# Altium schematic sheet P1.schdoc
size 420 x 297 mm; Symbol: Drawing-Symbol_A4; Company: 嘉立创EDA; Version: V1.0; Page Size: A4; @Project Name: 24V控制器3; @Update Date: 2026-08-31; @Create Date: 2026-08-31; Device: Drawing-Symbol_A4; @Board Name: Board1; @Page Name: P1; @Create Time: 10:06:53; @Page Count: 1; @Page No: 1; @Schematic Name: Schematic1; @Update Time: 10:06:53; @Assembly Variant: Basic; Border: 1; Title Block Position: 3; Size: A4; Width: 1655; Height: 1170; Region Start: 1; X Region Count: 6; Y Region Count: 4; Blade Width: 10; SheetNumber: 1; SheetTotal: 1
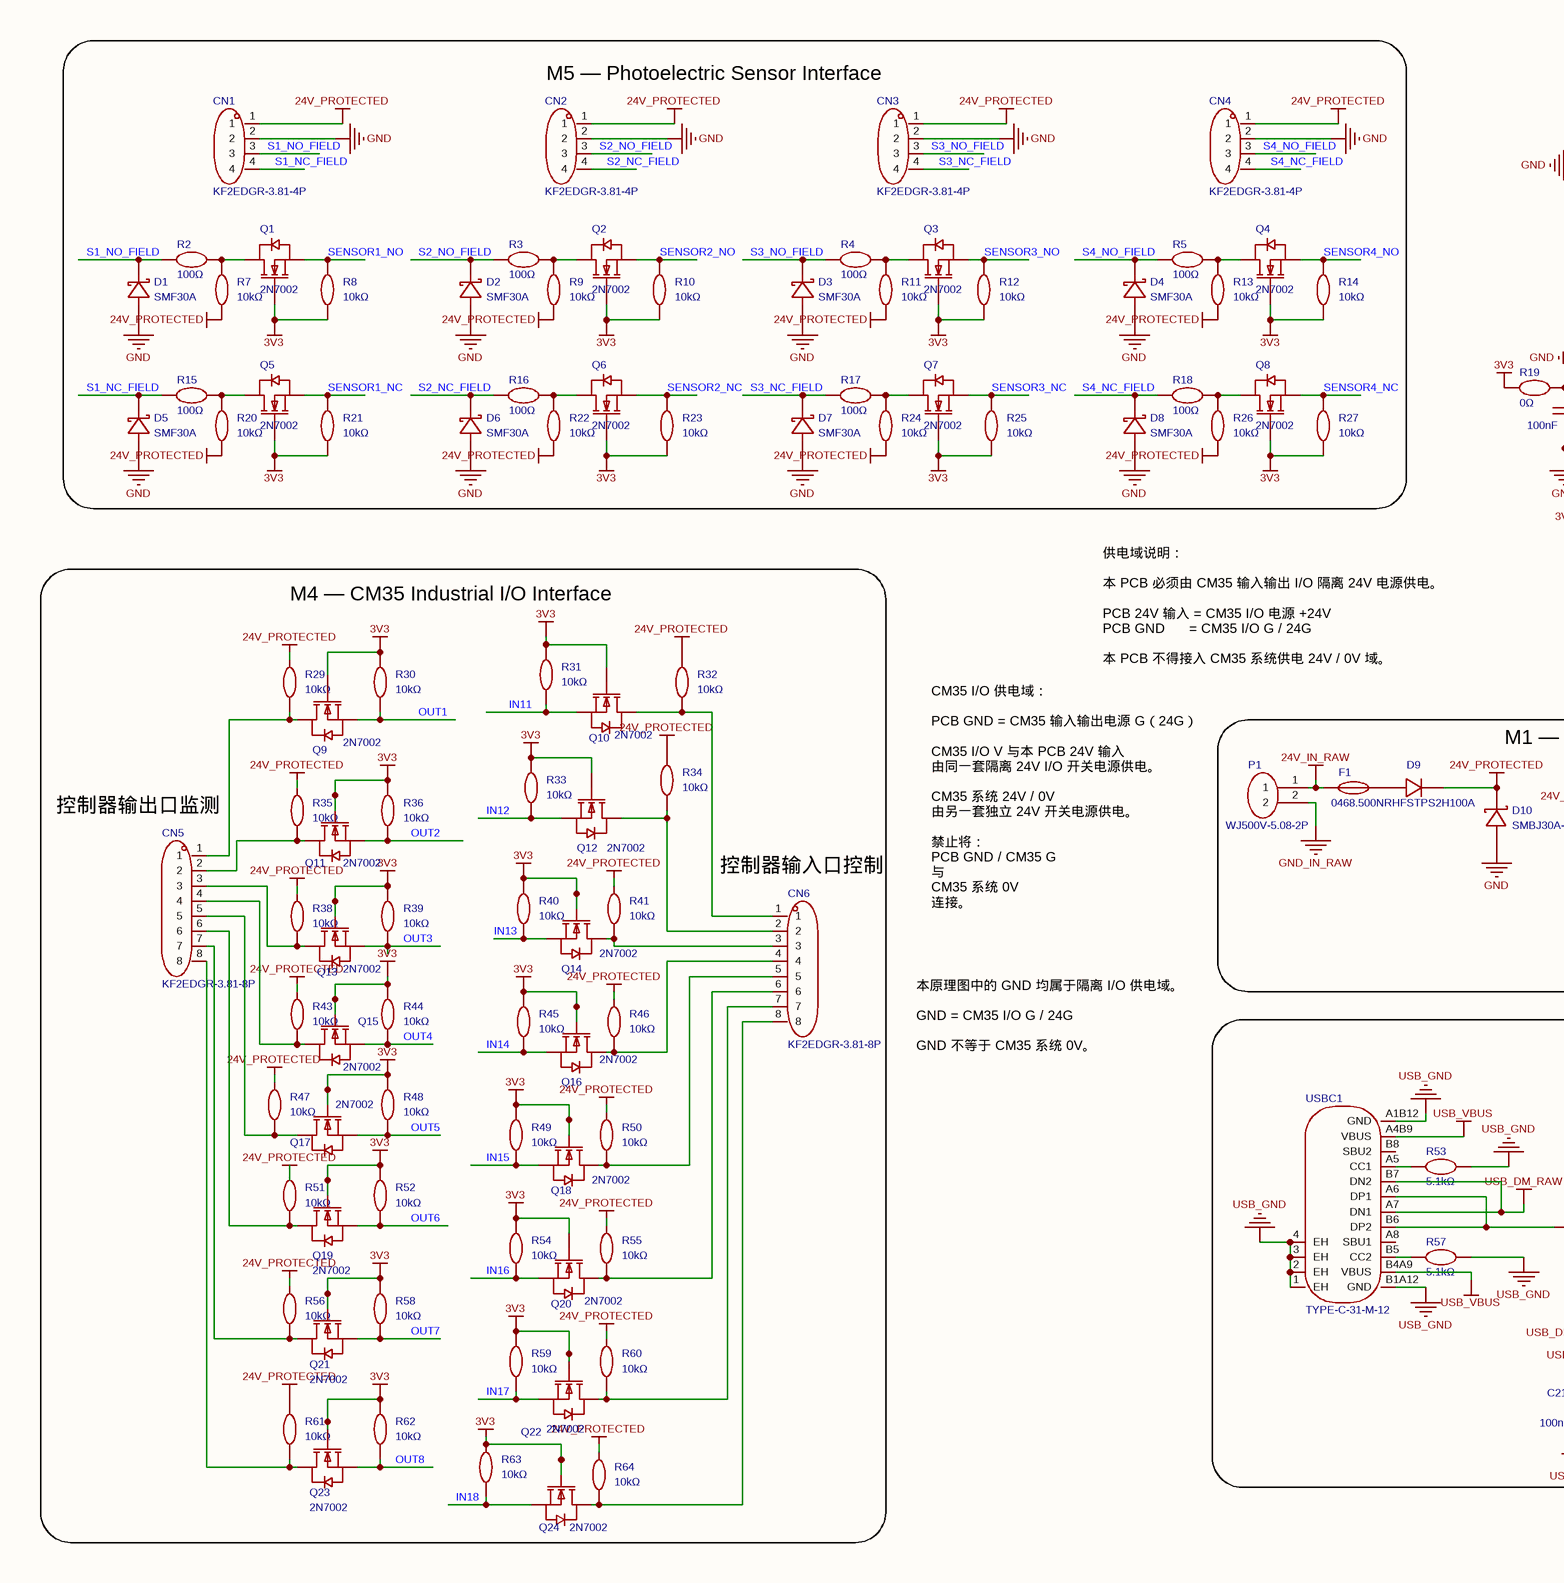
[diagram p0: P1.schdoc, left]
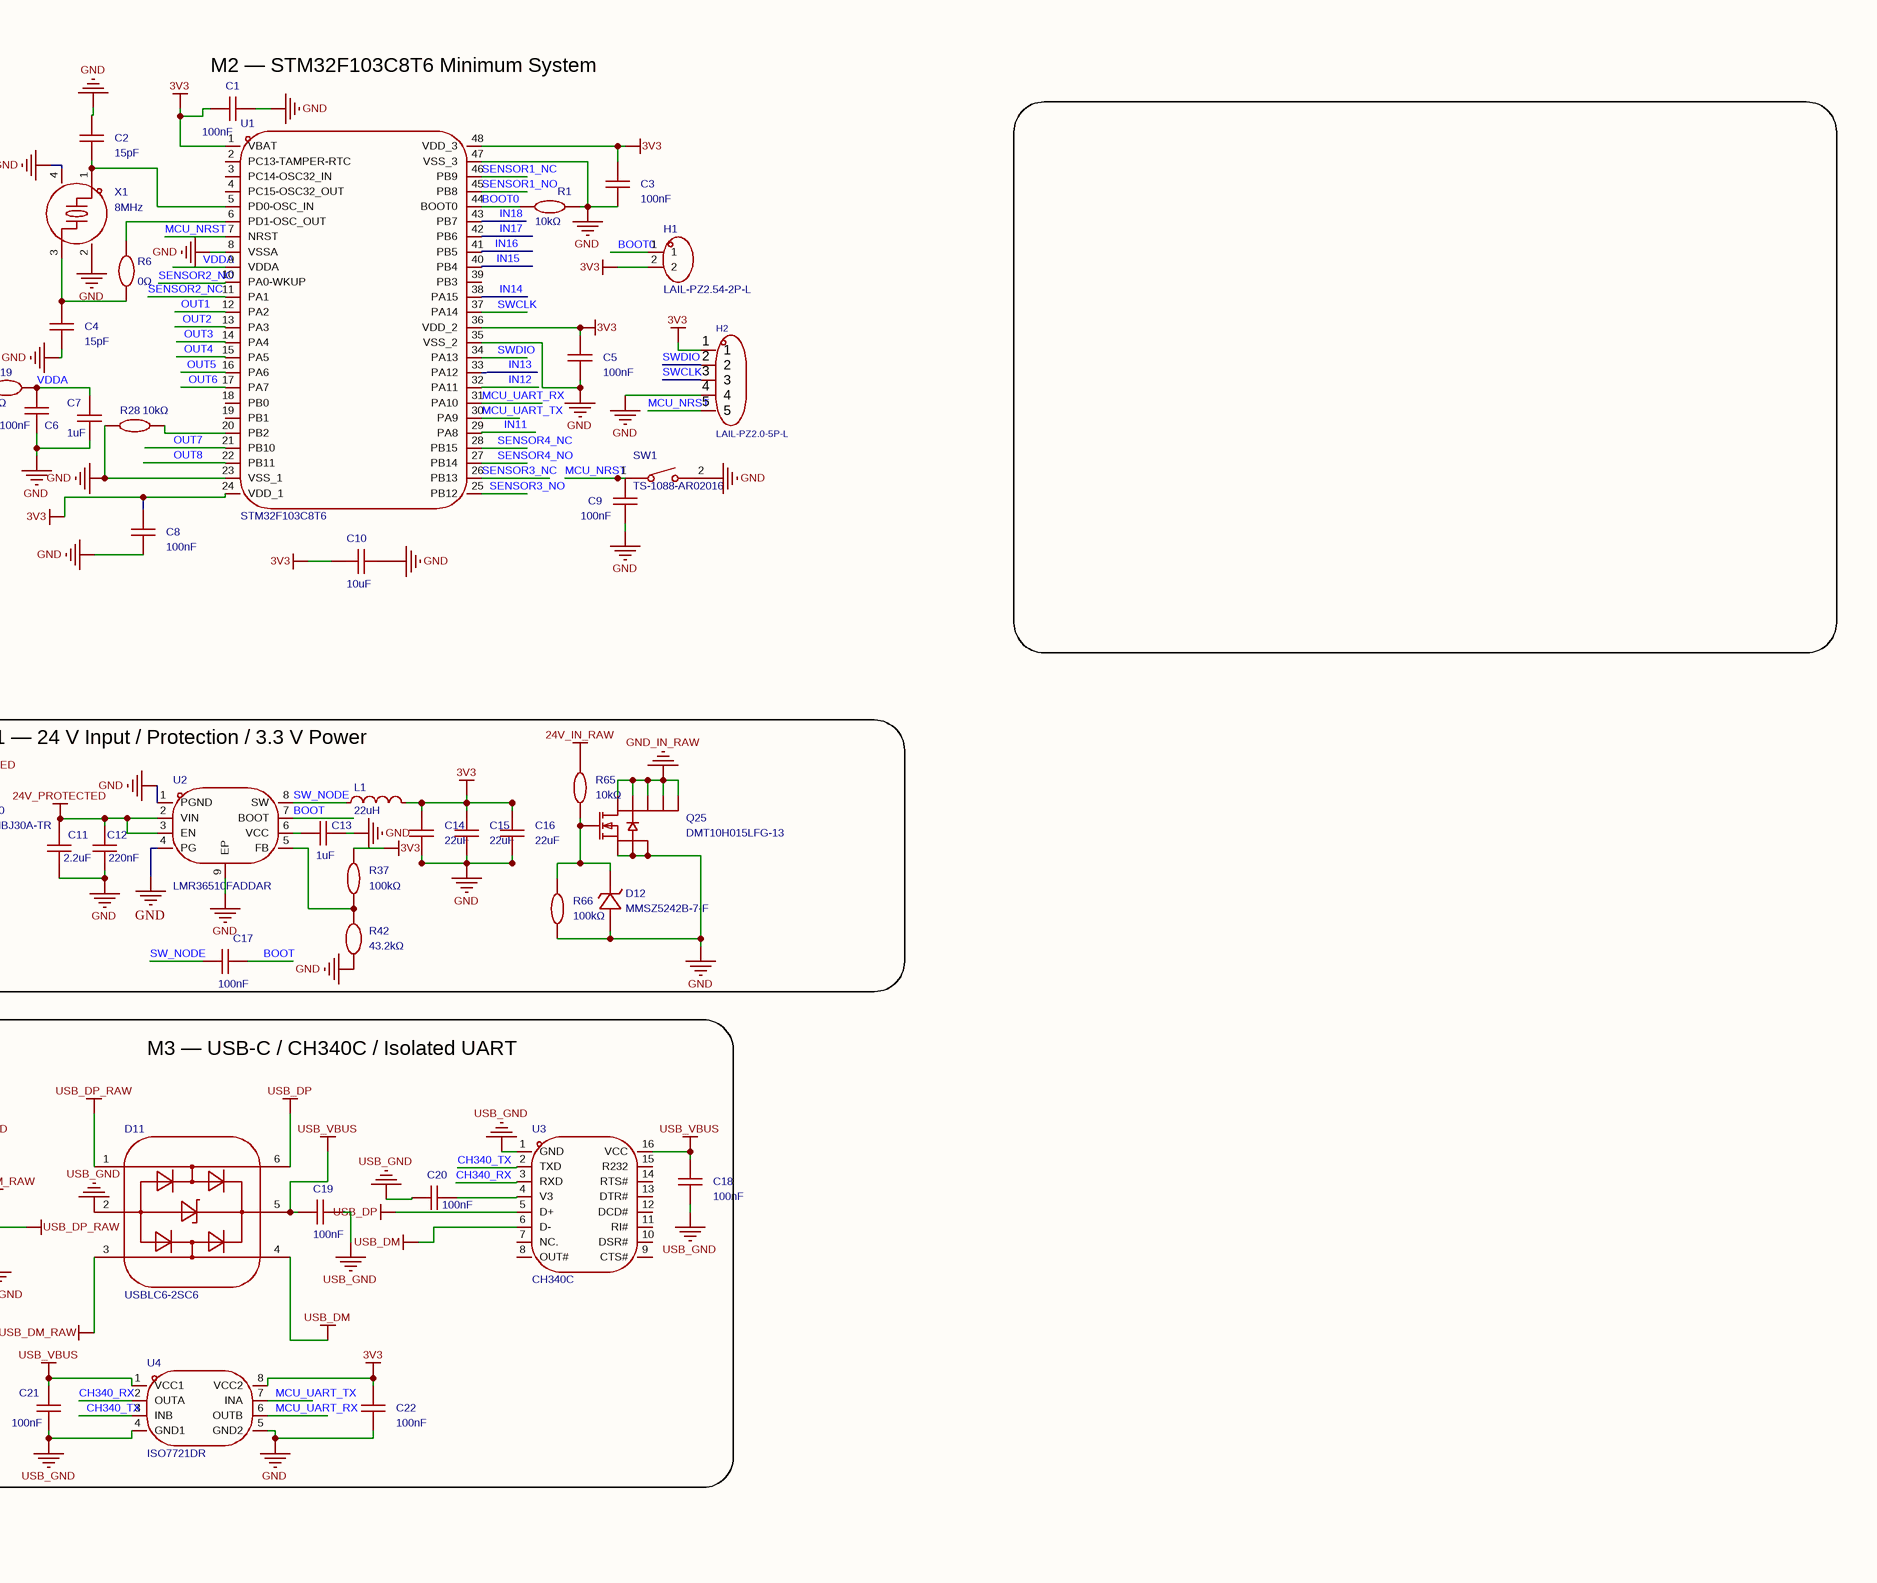
[diagram p1: P1.schdoc, right]

## Parts
C1  100nF  [C0603]
C2  15pF  [C0603]
C3  100nF  [C0603]
C4  15pF  [C0603]
C5  100nF  [C0603]
C6  100nF  [C0603]
C7  1uF  [C0603]
C8  100nF  [C0603]
C9  100nF  [C0603]
C10  10uF  [C0805]
C11  2.2uF  [C1206]
C12  220nF  [C0805]
C13  1uF  [C0603]
C14  22uF  [C1206]
C15  22uF  [C1206]
C16  22uF  [C1206]
C17  100nF  [C0603]
C18  100nF  [C0603]
C19  100nF  [C0603]
C20  100nF  [C0603]
C21  100nF  [C0603]
C22  100nF  [C0603]
CN1  KF2EDGR-3.81-4P  [CONN-TH_4P-P3.81_KF2EDGR-3.81-4P]
CN2  KF2EDGR-3.81-4P  [CONN-TH_4P-P3.81_KF2EDGR-3.81-4P]
CN3  KF2EDGR-3.81-4P  [CONN-TH_4P-P3.81_KF2EDGR-3.81-4P]
CN4  KF2EDGR-3.81-4P  [CONN-TH_4P-P3.81_KF2EDGR-3.81-4P]
CN5  KF2EDGR-3.81-8P  [CONN-TH_8P-P3.81_KF2EDGR-3.81-8P]
CN6  KF2EDGR-3.81-8P  [CONN-TH_8P-P3.81_KF2EDGR-3.81-8P]
D1  SMF30A  [SOD-123FL_L2.7-W1.8-LS3.7-R-RD]
D2  SMF30A  [SOD-123FL_L2.7-W1.8-LS3.7-R-RD]
D3  SMF30A  [SOD-123FL_L2.7-W1.8-LS3.7-R-RD]
D4  SMF30A  [SOD-123FL_L2.7-W1.8-LS3.7-R-RD]
D5  SMF30A  [SOD-123FL_L2.7-W1.8-LS3.7-R-RD]
D6  SMF30A  [SOD-123FL_L2.7-W1.8-LS3.7-R-RD]
D7  SMF30A  [SOD-123FL_L2.7-W1.8-LS3.7-R-RD]
D8  SMF30A  [SOD-123FL_L2.7-W1.8-LS3.7-R-RD]
D9  STPS2H100A  [SMA_L4.4-W2.6-LS5.0-RD]
D10  SMBJ30A-TR  [SMB_L4.6-W3.6-LS5.3-RD]
D11  USBLC6-2SC6  [SOT-23-6_L2.9-W1.6-P0.95-LS2.8-BL]
D12  MMSZ5242B-7-F  [SOD-123_L2.7-W1.6-LS3.7-RD-1]
F1  0468.500NRHF  [F1206]
H1  LAIL-PZ2.54-2P-L  [CONN-TH_LAIL-PZ2.54-2P-L]
H2  LAIL-PZ2.0-5P-L  [HDR-TH_LAIL-PZ2.0-5P-L]
L1  22uH  [IND-SMD_L6.0-W6.0_SWPA6045S]
P1  WJ500V-5.08-2P  [CONN-TH_2P-P5.00_WJ500V-5.08-2P]
Q1  2N7002  [SOT-23-3_L2.9-W1.3-P1.90-LS2.4-BR]
Q2  2N7002  [SOT-23-3_L2.9-W1.3-P1.90-LS2.4-BR]
Q3  2N7002  [SOT-23-3_L2.9-W1.3-P1.90-LS2.4-BR]
Q4  2N7002  [SOT-23-3_L2.9-W1.3-P1.90-LS2.4-BR]
Q5  2N7002  [SOT-23-3_L2.9-W1.3-P1.90-LS2.4-BR]
Q6  2N7002  [SOT-23-3_L2.9-W1.3-P1.90-LS2.4-BR]
Q7  2N7002  [SOT-23-3_L2.9-W1.3-P1.90-LS2.4-BR]
Q8  2N7002  [SOT-23-3_L2.9-W1.3-P1.90-LS2.4-BR]
Q9  2N7002  [SOT-23-3_L2.9-W1.3-P1.90-LS2.4-BR]
Q10  2N7002  [SOT-23-3_L2.9-W1.3-P1.90-LS2.4-BR]
Q11  2N7002  [SOT-23-3_L2.9-W1.3-P1.90-LS2.4-BR]
Q12  2N7002  [SOT-23-3_L2.9-W1.3-P1.90-LS2.4-BR]
Q13  2N7002  [SOT-23-3_L2.9-W1.3-P1.90-LS2.4-BR]
Q14  2N7002  [SOT-23-3_L2.9-W1.3-P1.90-LS2.4-BR]
Q15  2N7002  [SOT-23-3_L2.9-W1.3-P1.90-LS2.4-BR]
Q16  2N7002  [SOT-23-3_L2.9-W1.3-P1.90-LS2.4-BR]
Q17  2N7002  [SOT-23-3_L2.9-W1.3-P1.90-LS2.4-BR]
Q18  2N7002  [SOT-23-3_L2.9-W1.3-P1.90-LS2.4-BR]
Q19  2N7002  [SOT-23-3_L2.9-W1.3-P1.90-LS2.4-BR]
Q20  2N7002  [SOT-23-3_L2.9-W1.3-P1.90-LS2.4-BR]
Q21  2N7002  [SOT-23-3_L2.9-W1.3-P1.90-LS2.4-BR]
Q22  2N7002  [SOT-23-3_L2.9-W1.3-P1.90-LS2.4-BR]
Q23  2N7002  [SOT-23-3_L2.9-W1.3-P1.90-LS2.4-BR]
Q24  2N7002  [SOT-23-3_L2.9-W1.3-P1.90-LS2.4-BR]
Q25  DMT10H015LFG-13  [POWERDI3333-8_L3.3-W3.3-P0.65-LS3.7-BL-EP]
R1  10kΩ  [R0603]
R2  100Ω  [R0603]
R3  100Ω  [R0603]
R4  100Ω  [R0603]
R5  100Ω  [R0603]
R6  0Ω  [R0603]
R7  10kΩ  [R0603]
R8  10kΩ  [R0603]
R9  10kΩ  [R0603]
R10  10kΩ  [R0603]
R11  10kΩ  [R0603]
R12  10kΩ  [R0603]
R13  10kΩ  [R0603]
R14  10kΩ  [R0603]
R15  100Ω  [R0603]
R16  100Ω  [R0603]
R17  100Ω  [R0603]
R18  100Ω  [R0603]
R19  0Ω  [R0603]
R20  10kΩ  [R0603]
R21  10kΩ  [R0603]
R22  10kΩ  [R0603]
R23  10kΩ  [R0603]
R24  10kΩ  [R0603]
R25  10kΩ  [R0603]
R26  10kΩ  [R0603]
R27  10kΩ  [R0603]
R28  10kΩ  [R0603]
R29  10kΩ  [R0603]
R30  10kΩ  [R0603]
R31  10kΩ  [R0603]
R32  10kΩ  [R0603]
R33  10kΩ  [R0603]
R34  10kΩ  [R0603]
R35  10kΩ  [R0603]
R36  10kΩ  [R0603]
R37  100kΩ  [R0603]
R38  10kΩ  [R0603]
R39  10kΩ  [R0603]
R40  10kΩ  [R0603]
R41  10kΩ  [R0603]
R42  43.2kΩ  [R0603]
R43  10kΩ  [R0603]
R44  10kΩ  [R0603]
R45  10kΩ  [R0603]
R46  10kΩ  [R0603]
R47  10kΩ  [R0603]
R48  10kΩ  [R0603]
R49  10kΩ  [R0603]
R50  10kΩ  [R0603]
R51  10kΩ  [R0603]
R52  10kΩ  [R0603]
R53  5.1kΩ  [R0603]
R54  10kΩ  [R0603]
R55  10kΩ  [R0603]
R56  10kΩ  [R0603]
R57  5.1kΩ  [R0603]
R58  10kΩ  [R0603]
R59  10kΩ  [R0603]
R60  10kΩ  [R0603]
R61  10kΩ  [R0603]
R62  10kΩ  [R0603]
R63  10kΩ  [R0603]
R64  10kΩ  [R0603]
R65  10kΩ  [R0603]
R66  100kΩ  [R0603]
SW1  TS-1088-AR02016  [SW-SMD_L3.9-W3.0-P4.45]
U1  STM32F103C8T6  [LQFP-48_L7.0-W7.0-P0.50-LS9.0-BL]
U2  LMR36510FADDAR  [ESOP-8_L4.9-W3.9-P1.27-LS6.0-BL-EP-1]
U3  CH340C  [SOP-16_L10.0-W3.9-P1.27-LS6.0-BL]
U4  ISO7721DR  [SOIC-8_L5.0-W4.0-P1.27-LS6.0-BL]
USBC1  TYPE-C-31-M-12  [USB-C_SMD-TYPE-C-31-M-12_1]
X1  8MHz  [CRYSTAL-SMD_4P-L3.2-W2.5-BL]

## Blocks framed on the sheet
M5 — Photoelectric Sensor Interface: CN1-CN4 D1-D8 Q1-Q8 R2-R5 R7-R18 R20-R27
M1 — 24 V Input / Protection / 3.3 V Power: C11-C17 D9 D10 D12 F1 L1 P1 Q25 R37 R42 R65 R66 U2
M3 — USB-C / CH340C / Isolated UART: C18-C22 D11 R53 R57 U3 U4 USBC1

## Nets
3V3: C1.2 C3.2 C5.2 C8.2 C10.1 C14.2 C15.2 C16.2 C22.2 H1.2 H2.1 L1.2 Q1.1(G) Q2.1(G) Q3.1(G) Q4.1(G) Q5.1(G) Q6.1(G) Q7.1(G) Q8.1(G) Q9.1(G) Q10.1(G) Q11.1(G) Q12.1(G) Q13.1(G) Q14.1(G) Q15.1(G) Q16.1(G) Q17.1(G) Q18.1(G) Q19.1(G) Q20.1(G) Q21.1(G) Q22.1(G) Q23.1(G) Q24.1(G) R8.1 R10.1 R12.1 R14.1 R19.1 R21.1 R23.1 R25.1 R27.1 R30.2 R31.2 R33.2 R36.2 R37.2 R39.2 R40.2 R44.2 R45.2 R48.2 R49.2 R52.2 R54.2 R58.2 R59.2 R62.2 R63.2 U1.1(VBAT) U1.24(VDD_1) U1.36(VDD_2) U1.48(VDD_3) U4.8(VCC2)
24V_IN_RAW: F1.1 P1.1 R65.2
24V_PROTECTED: C11.2 C12.2 CN1.1 CN2.1 CN3.1 CN4.1 D9.1(C) D10.1(K) R7.1 R9.1 R11.1 R13.1 R20.1 R22.1 R24.1 R26.1 R29.2 R32.2 R34.2 R35.2 R38.2 R41.2 R43.2 R46.2 R47.2 R50.2 R51.2 R55.2 R56.2 R60.2 R61.2 R64.2 U2.2(VIN) U2.3(EN)
GND: C1.1 C2.1 C3.1 C4.2 C5.1 C6.1 C7.1 C8.1 C9.1 C10.2 C11.1 C12.1 C13.1 C14.1 C15.1 C16.1 C22.1 CN1.2 CN2.2 CN3.2 CN4.2 D1.1(A) D2.1(A) D3.1(A) D4.1(A) D5.1(A) D6.1(A) D7.1(A) D8.1(A) D10.2(A) D12.2(A) H2.4 Q25.1(S) Q25.2(S) Q25.3(S) R1.2 R28.1 R42.1 R66.1 SW1.2 U1.8(VSSA) U1.23(VSS_1) U1.35(VSS_2) U1.47(VSS_3) U2.1(PGND) U2.4(PG) U2.9(EP) U4.5(GND2) X1.2(GND) X1.4(GND)
GND_IN_RAW: P1.2 Q25.5(D) Q25.6(D) Q25.7(D) Q25.8(D) Q25.9(D)
USB_DM: D11.4 U3.6(D-)
USB_DM_RAW: D11.3 USBC1.A7(DN1) USBC1.B7(DN2)
USB_DP: D11.6 U3.5(D+)
USB_DP_RAW: D11.1 USBC1.A6(DP1) USBC1.B6(DP2)
USB_GND: C18.1 C19.2 C20.1 C21.1 D11.2 R53.1 R57.1 U3.1(GND) U4.4(GND1) USBC1.1(EH) USBC1.2(EH) USBC1.3(EH) USBC1.4(EH) USBC1.A1B12(GND) USBC1.B1A12(GND)
USB_VBUS: C18.2 C19.1 C21.2 D11.5 U3.16(VCC) U4.1(VCC1) USBC1.A4B9(VBUS) USBC1.B4A9(VBUS)
BOOT: C17.2 U2.7(BOOT)
BOOT0: H1.1 R1.1 U1.44(BOOT0)
CH340_RX: U3.3(RXD) U4.2(OUTA)
CH340_TX: U3.2(TXD) U4.3(INB)
IN11: Q10.2(S) R31.1 U1.29(PA8)
IN12: Q12.2(S) R33.1 U1.32(PA11)
IN13: Q14.2(S) R40.1 U1.33(PA12)
IN14: Q16.2(S) R45.1 U1.38(PA15)
IN15: Q18.2(S) R49.1 U1.40(PB4)
IN16: Q20.2(S) R54.1 U1.41(PB5)
IN17: Q22.2(S) R59.1 U1.42(PB6)
IN18: Q24.2(S) R63.1 U1.43(PB7)
MCU_NRST: C9.2 H2.5 SW1.1 U1.7(NRST)
MCU_UART_RX: U1.31(PA10) U4.6(OUTB)
MCU_UART_TX: U1.30(PA9) U4.7(INA)
OUT1: Q9.2(S) R30.1 U1.12(PA2)
OUT2: Q11.2(S) R36.1 U1.13(PA3)
OUT3: Q13.2(S) R39.1 U1.14(PA4)
OUT4: Q15.2(S) R44.1 U1.15(PA5)
OUT5: Q17.2(S) R48.1 U1.16(PA6)
OUT6: Q19.2(S) R52.1 U1.17(PA7)
OUT7: Q21.2(S) R58.1 U1.21(PB10)
OUT8: Q23.2(S) R62.1 U1.22(PB11)
S1_NC_FIELD: CN1.4 D5.2(K) R15.1
S1_NO_FIELD: CN1.3 D1.2(K) R2.1
S2_NC_FIELD: CN2.4 D6.2(K) R16.1
S2_NO_FIELD: CN2.3 D2.2(K) R3.1
S3_NC_FIELD: CN3.4 D7.2(K) R17.1
S3_NO_FIELD: CN3.3 D3.2(K) R4.1
S4_NC_FIELD: CN4.4 D8.2(K) R18.1
S4_NO_FIELD: CN4.3 D4.2(K) R5.1
SENSOR1_NC: Q5.2(S) R21.2 U1.46(PB9)
SENSOR1_NO: Q1.2(S) R8.2 U1.45(PB8)
SENSOR2_NC: Q6.2(S) R23.2 U1.11(PA1)
SENSOR2_NO: Q2.2(S) R10.2 U1.10(PA0-WKUP)
SENSOR3_NC: Q7.2(S) R25.2 U1.26(PB13)
SENSOR3_NO: Q3.2(S) R12.2 U1.25(PB12)
SENSOR4_NC: Q8.2(S) R27.2 U1.28(PB15)
SENSOR4_NO: Q4.2(S) R14.2 U1.27(PB14)
SW_NODE: C17.1 L1.1 U2.8(SW)
SWCLK: H2.3 U1.37(PA14)
SWDIO: H2.2 U1.34(PA13)
VDDA: C6.2 C7.2 R19.2 U1.9(VDDA)
NetC2_2: C2.2 U1.5(PD0-OSC_IN) X1.1(CRYSTAL)
NetC4_1: C4.1 R6.1 X1.3(CRYSTAL)
NetC13_2: C13.2 U2.6(VCC)
NetC20_2: C20.2 U3.4(V3)
NetCN5_1: CN5.1 Q9.3(D) R29.1
NetCN5_2: CN5.2 Q11.3(D) R35.1
NetCN5_3: CN5.3 Q13.3(D) R38.1
NetCN5_4: CN5.4 Q15.3(D) R43.1
NetCN5_5: CN5.5 Q17.3(D) R47.1
NetCN5_6: CN5.6 Q19.3(D) R51.1
NetCN5_7: CN5.7 Q21.3(D) R56.1
NetCN5_8: CN5.8 Q23.3(D) R61.1
NetCN6_1: CN6.1 Q10.3(D) R32.1
NetCN6_2: CN6.2 Q12.3(D) R34.1
NetCN6_3: CN6.3 Q14.3(D) R41.1
NetCN6_4: CN6.4 Q16.3(D) R46.1
NetCN6_5: CN6.5 Q18.3(D) R50.1
NetCN6_6: CN6.6 Q20.3(D) R55.1
NetCN6_7: CN6.7 Q22.3(D) R60.1
NetCN6_8: CN6.8 Q24.3(D) R64.1
NetD9_2: D9.2(A) F1.2
NetD12_1: D12.1(K) Q25.4(G) R65.1 R66.2
NetQ1_3: Q1.3(D) R2.2 R7.2
NetQ2_3: Q2.3(D) R3.2 R9.2
NetQ3_3: Q3.3(D) R4.2 R11.2
NetQ4_3: Q4.3(D) R5.2 R13.2
NetQ5_3: Q5.3(D) R15.2 R20.2
NetQ6_3: Q6.3(D) R16.2 R22.2
NetQ7_3: Q7.3(D) R17.2 R24.2
NetQ8_3: Q8.3(D) R18.2 R26.2
NetR6_2: R6.2 U1.6(PD1-OSC_OUT)
NetR28_2: R28.2 U1.20(PB2)
NetR37_1: R37.1 R42.2 U2.5(FB)
NetR53_2: R53.2 USBC1.A5(CC1)
NetR57_2: R57.2 USBC1.B5(CC2)

Not connected (* = marked no-connect by the designer): U1 2(PC13-TAMPER-RTC) 3(PC14-OSC32_IN) 4(PC15-OSC32_OUT) 18(PB0) 19(PB1) 39(PB3); U3 7(NC.) 8(OUT#) 9(CTS#) 10(DSR#) 11(RI#) 12(DCD#) 13(DTR#) 14(RTS#) 15(R232); USBC1 A8(SBU1) B8(SBU2)

## Notes on the sheet
- (near C1) M2 — STM32F103C8T6 Minimum System
- M4 — CM35 Industrial I/O Interface
- 控制器输出口监测
- (near P1) 供电域说明：
  本 PCB 必须由 CM35 输入输出 I/O 隔离 24V 电源供电。
  PCB 24V 输入 = CM35 I/O 电源 +24V
  PCB GND      = CM35 I/O G / 24G
  本 PCB 不得接入 CM35 系统供电 24V / 0V 域。
- (near CN6) 控制器输入口控制
- CM35 I/O 供电域：
  PCB GND = CM35 输入输出电源 G（24G）
  CM35 I/O V 与本 PCB 24V 输入
  由同一套隔离 24V I/O 开关电源供电。
  CM35 系统 24V / 0V
  由另一套独立 24V 开关电源供电。
  禁止将：
  PCB GND / CM35 G
  与
  CM35 系统 0V
  连接。
- 本原理图中的 GND 均属于隔离 I/O 供电域。
  GND = CM35 I/O G / 24G
  GND 不等于 CM35 系统 0V。

## Library data of the parts
C1 C3 C5 C6 C8 C9 C17-C22 = 0603B104K500NT: 容值:100nF;精度:±10%;额定电压:50V;温度系数:X7R;; Manufacturer: FH(风华); Add into BOM: yes; 3D Model: ac125912035d415993ca9572d50418b1; 3D Model Transform: 62.992,31.496,0,0,0,0,0,0,0; Tolerance: ±10%; Voltage Rating: 50V; Temperature Coefficient: X7R; ModelName: C0603_L1.6-W0.8-H0.8; Symbol: 0603B104K500NT; Device: 0603B104K500NT; Convert to PCB: yes; Supplier Footprint: 0603; Value: 100nF; LCSC Part Name: 100nF ±10% 50V; Supplier Part: C30926; Manufacturer Part: 0603B104K500NT; JLCPCB Part Class: Extended Part; Datasheet: https://item.szlcsc.com/datasheet/0603B104K500NT/31683.html; Supplier: LCSC; FootprintName: C0603
C2 C4 = CL10C150JB8NNNC: 容值:15pF;精度:±5%;额定电压:50V;温度系数:C0G;; Manufacturer: SAMSUNG(三星); Add into BOM: yes; 3D Model: ac125912035d415993ca9572d50418b1; 3D Model Transform: 62.992,31.496,0,0,0,0,0,0,0; Tolerance: ±5%; Voltage Rating: 50V; Temperature Coefficient: C0G; ModelName: C0603_L1.6-W0.8-H0.8; Symbol: CL10C150JB8NNNC; Device: CL10C150JB8NNNC; Convert to PCB: yes; Value: 15pF; Supplier Footprint: 0603; LCSC Part Name: 15pF ±5% 50V; Supplier Part: C1644; Manufacturer Part: CL10C150JB8NNNC; JLCPCB Part Class: Basic Part; Datasheet: https://item.szlcsc.com/datasheet/CL10C150JB8NNNC/1996.html; Supplier: LCSC; FootprintName: C0603
C7 C13 = CL10B105KA8NNNC: 容值:1uF;精度:±10%;额定电压:25V;温度系数:X7R;; Manufacturer: SAMSUNG(三星); Add into BOM: yes; 3D Model: ac125912035d415993ca9572d50418b1; 3D Model Transform: 62.992,31.496,0,0,0,0,0,0,0; Tolerance: ±10%; Voltage Rating: 25V; Temperature Coefficient: X7R; ModelName: C0603_L1.6-W0.8-H0.8; Symbol: CL10B105KA8NNNC; Device: CL10B105KA8NNNC; Convert to PCB: yes; Value: 1uF; Supplier Footprint: 0603; LCSC Part Name: 1uF ±10% 25V; Supplier Part: C29936; Manufacturer Part: CL10B105KA8NNNC; JLCPCB Part Class: Extended Part; Datasheet: https://item.szlcsc.com/datasheet/CL10B105KA8NNNC/30690.html; Supplier: LCSC; FootprintName: C0603
C10 = CL21A106KAYNNNE_C15850: 容值:10uF;精度:±10%;额定电压:25V;温度系数:X5R;; Manufacturer: SAMSUNG(三星); Add into BOM: yes; 3D Model: 1ba041120af144c991958decab20d241; 3D Model Transform: 78.74,51.181,0,0,0,0,0,0.0005,0; Tolerance: ±10%; Voltage Rating: 25V; Temperature Coefficient: X5R; ModelName: C0805_L2.0-W1.3-H1.3; Symbol: CL21A106KAYNNNE; Device: CL21A106KAYNNNE_C15850; Convert to PCB: yes; Value: 10uF; Supplier Footprint: 0805; LCSC Part Name: 10uF ±10% 25V; Supplier Part: C15850; Manufacturer Part: CL21A106KAYNNNE; JLCPCB Part Class: Basic Part; Datasheet: https://item.szlcsc.com/datasheet/CL21A106KAYNNNE/16532.html; Supplier: LCSC; FootprintName: C0805
C11 = CC1206KKX7R0BB225: 容值:2.2uF;精度:±10%;额定电压:100V;温度系数:X7R;; Manufacturer: YAGEO(国巨); Add into BOM: yes; 3D Model: e4be705b945545a48e666415e3682bd8; 3D Model Transform: 125.984,62.992,0,0,0,0,0,0,0; Tolerance: ±10%; Voltage Rating: 100V; Temperature Coefficient: X7R; ModelName: C1206_L3.2-W1.6-H1.3; Symbol: CC1206KKX7R0BB225; Device: CC1206KKX7R0BB225; Convert to PCB: yes; Value: 2.2uF; Supplier Footprint: 1206; LCSC Part Name: 2.2uF ±10% 100V; Supplier Part: C577211; Manufacturer Part: CC1206KKX7R0BB225; JLCPCB Part Class: Extended Part; Datasheet: https://item.szlcsc.com/datasheet/CC1206KKX7R0BB225/604702.html; Supplier: LCSC; FootprintName: C1206
C12 = CC0805KKX7R0BB224: 容值:220nF;精度:±10%;额定电压:100V;温度系数:X7R;; Manufacturer: YAGEO(国巨); Add into BOM: yes; 3D Model: 1ba041120af144c991958decab20d241; 3D Model Transform: 78.74,51.181,0,0,0,0,0,0.0005,0; Tolerance: ±10%; Voltage Rating: 100V; Temperature Coefficient: X7R; ModelName: C0805_L2.0-W1.3-H1.3; Symbol: CC0805KKX7R0BB224; Device: CC0805KKX7R0BB224; Convert to PCB: yes; Value: 220nF; Supplier Footprint: 0805; LCSC Part Name: 220nF ±10% 100V; Supplier Part: C513710; Manufacturer Part: CC0805KKX7R0BB224; JLCPCB Part Class: Extended Part; Datasheet: https://item.szlcsc.com/datasheet/CC0805KKX7R0BB224/528537.html; Supplier: LCSC; FootprintName: C0805
C14-C16 = CL31B226KPHNNNE: 容值:22uF;精度:±10%;额定电压:10V;温度系数:X7R;; Manufacturer: SAMSUNG(三星); Add into BOM: yes; 3D Model: e4be705b945545a48e666415e3682bd8; 3D Model Transform: 125.984,62.992,0,0,0,0,0,0,0; Tolerance: ±10%; Voltage Rating: 10V; Temperature Coefficient: X7R; ModelName: C1206_L3.2-W1.6-H1.3; Symbol: CL31B226KPHNNNE; Device: CL31B226KPHNNNE; Convert to PCB: yes; Value: 22uF; Supplier Footprint: 1206; LCSC Part Name: 22uF ±10% 10V; Supplier Part: C87996; Manufacturer Part: CL31B226KPHNNNE; JLCPCB Part Class: Extended Part; Datasheet: https://item.szlcsc.com/datasheet/CL31B226KPHNNNE/89174.html; Supplier: LCSC; FootprintName: C1206
CN1-CN4 = KF2EDGR-3.81-4P: 连接器类型:板端/插座-闭口;结构:1x4P;间距:3.81mm;颜色:绿色;安装方式:弯插;排数:1;每排PIN数:4;额定电流:8A;额定电压:300V;工作温度:-40℃~+105℃;; Manufacturer: KEFA(科发); AddInBom: yes; ModelId: 92f33792c81f433e85da8d70412a8b64聨0819f05c4eef4c71ace90d822a990e87; ModelName: CONN-TH_KF3.81-WI-4P; ModelTransform: 634.644,360.2355,0,0,0,0,0,-118.11,-137.795; Number of Positions or Pins: 1x4P; Pitch: 3.81mm; Number of PINs Per Row: 4; Current Rating: 8A; Voltage Rating (Max): 300V; Symbol: KF2EDGR-3.81-4P; Device: KF2EDGR-3.81-4P; LCSC Part Name: 1x4P 3.81mm 排数:1 每排P数:4; SupplierPart: C441184; ManufacturerPart: KF2EDGR-3.81-4P; Supplier Footprint: 弯插,P=3.81mm; JLCPCB Part Class: Extended Part; Datasheet: https://item.szlcsc.com/datasheet/KF2EDGR-3.81-4P/441157.html; Supplier: LCSC; ConvertToPcb: yes; FootprintName: CONN-TH_4P-P3.81_KF2EDGR-3.81-4P; Connector Type: 板端/插座-闭口; Color: 绿色; Mounting Type: 弯插; Number of Pins: 4P; Number of Rows: 1; Operating Temperature: -40℃~+105℃
CN5 CN6 = KF2EDGR-3.81-8P: 连接器类型:板端/插座-闭口;结构:1x8P;间距:3.81mm;颜色:绿色;安装方式:弯插;排数:1;每排PIN数:8;额定电流:8A;额定电压:300V;工作温度:-40℃~+105℃;; Manufacturer: KEFA(科发); AddInBom: yes; ModelId: d9aa468e28fd44bdb19493be11d6b8ec聨0819f05c4eef4c71ace90d822a990e87; ModelTransform: 1231.4936,362.204,0,0,0,0,0,-129.882,-149.606; Number of Positions or Pins: 1x8P; Pitch: 3.81mm; Number of PINs Per Row: 8; Current Rating: 8A; Voltage Rating (Max): 300V; Symbol: KF2EDGR-3.81-8P; Device: KF2EDGR-3.81-8P; LCSC Part Name: 1x8P 3.81mm 排数:1 每排P数:8; SupplierPart: C441188; ManufacturerPart: KF2EDGR-3.81-8P; Supplier Footprint: 弯插,P=3.81mm; JLCPCB Part Class: Extended Part; Datasheet: https://item.szlcsc.com/datasheet/KF2EDGR-3.81-8P/441161.html; Supplier: LCSC; ConvertToPcb: yes; FootprintName: CONN-TH_8P-P3.81_KF2EDGR-3.81-8P; ModelName: CONN-TH_8P-P3.81_KF2EDGR-3.81-8P; Connector Type: 板端/插座-闭口; Color: 绿色; Mounting Type: 弯插; Number of Pins: 8P; Number of Rows: 1; Operating Temperature: -40℃~+105℃
D1-D8 = SMF30A_C720060: 极性:单向;反向截止电压(Vrwm):30V;钳位电压:48.4V;峰值脉冲电流(Ipp):4.1A;峰值脉冲功率(Ppp):200W;击穿电压(VBR):33.3V;; Manufacturer: Littelfuse(美国力特); AddInBom: yes; ModelId: 51ab086dae9e4453b49fd2b9d25433ae聨0819f05c4eef4c71ace90d822a990e87; ModelTransform: 143.701,70.866,0,0,0,0,0,0,0; Polarity: 单向; Reverse Stand-Off Voltage (Vrwm): 30V; Clamping Voltage: 48.4V; Peak Pulse Current (Ipp): 4.1A; Peak Pulse Power Dissipation (Ppp): 200W; Voltage - Breakdown: 33.3V; Reverse Leakage Current (Ir): 1uA; Number of Channels: 单路; level of protection: IEC 61000-4-4；IEC 61000-4-2; Type: TVS; Symbol: SMF30A_C720060; Device: SMF30A_C720060; LCSC Part Name: 单向TVS 30V截止 峰值浪涌电流：4.1A; SupplierPart: C720060; ManufacturerPart: SMF30A; Supplier Footprint: SOD-123FL; JLCPCB Part Class: Extended Part; Datasheet: https://item.szlcsc.com/datasheet/SMF30A/763182.html; Supplier: LCSC; ConvertToPcb: yes; FootprintName: SOD-123FL_L2.7-W1.8-LS3.7-R-RD; ModelName: SOD-123FL_L2.7-W1.8-LS3.7-R-RD; Operating Temperature: -65℃~+150℃
D9 = STPS2H100A: 正向压降(Vf):790mV@2A;直流反向耐压(Vr):100V;整流电流:2A;; Manufacturer: ST(意法半导体); AddInBom: yes; ModelId: a2d22152f8d5421c8e96dbd56af7c345聨0819f05c4eef4c71ace90d822a990e87; ModelTransform: 204.724,98.425,0,0,0,0,0,0,0; Voltage - DC Reverse(Vr): 100V; Current - Rectified: 2A; Reverse Leakage Current (Ir): 1uA@100V; Non-Repetitive Peak Forward Surge Current: 75A; Symbol: STPS2H100A; Device: STPS2H100A; LCSC Part Name: 电压:100V 电流:2A; SupplierPart: C81548; ManufacturerPart: STPS2H100A; Supplier Footprint: SMA(DO-214AC); JLCPCB Part Class: Extended Part; Datasheet: https://item.szlcsc.com/datasheet/STPS2H100A/82700.html; Supplier: LCSC; ConvertToPcb: yes; FootprintName: SMA_L4.4-W2.6-LS5.0-RD; ModelName: SMA_L4.4-W2.6-LS5.0-RD; Voltage - Forward(Vf@If): 790mV@2A
D10 = SMBJ30A-TR: 极性:单向;反向截止电压(Vrwm):30V;钳位电压:64.3V;峰值脉冲电流(Ipp):13A;峰值脉冲功率(Ppp):4kW@8/20us;击穿电压(VBR):35.1V;; Manufacturer: ST(意法半导体); AddInBom: yes; ModelId: 5e8926c661484ff2a35b83e5ae62aeb9聨0819f05c4eef4c71ace90d822a990e87; ModelTransform: 212.598,141.732,0,0,0,0,0,0,0; Polarity: 单向; Reverse Stand-Off Voltage (Vrwm): 30V; Clamping Voltage: 64.3V; Peak Pulse Current (Ipp): 13A; Voltage - Breakdown: 35.1V; Reverse Leakage Current (Ir): 200nA; level of protection: IEC 61000-4-4；IEC 61000-4-2；IEC 61000-4-5; Type: TVS; Symbol: SMBJ30A-TR; Device: SMBJ30A-TR; LCSC Part Name: 单向TVS 30V截止 峰值浪涌电流：13A; SupplierPart: C133663; ManufacturerPart: SMBJ30A-TR; Supplier Footprint: SMB(DO-214AA); JLCPCB Part Class: Extended Part; Datasheet: https://item.szlcsc.com/datasheet/SMBJ30A-TR/144970.html; Supplier: LCSC; ConvertToPcb: yes; FootprintName: SMB_L4.6-W3.6-LS5.3-RD; ModelName: SMB_L4.6-W3.6-LS5.3-RD; Peak Pulse Power Dissipation (Ppp): 4kW@8/20us; Operating Temperature: -55℃~+150℃
D11 = USBLC6-2SC6_C7519: 极性:单向;反向截止电压(Vrwm):5.25V;钳位电压:17V;峰值脉冲电流(Ipp):5A;击穿电压:6V;; Manufacturer: ST(意法半导体); AddInBom: yes; ModelId: 18da8f6c14a34920b3e136b5c401a119聨0819f05c4eef4c71ace90d822a990e87; ModelName: SOT-23-6_L2.9-W1.6-H1.5-LS2.8-P0.95; ModelTransform: 110.236,113.364,0,90,0,0,0.0005,0.0005,0; Polarity: 单向; Reverse Stand-Off Voltage (Vrwm): 5.25V; Clamping Voltage: 17V; Peak Pulse Current (Ipp): 5A; Voltage - Breakdown: 6V; Reverse Leakage Current (Ir): 150nA; Number of Channels: 双路; level of protection: IEC 61000-4-2; Type: ESD; Junction Capacitance: 3.5pF; Symbol: USBLC6-2SC6; Device: USBLC6-2SC6_C7519; LCSC Part Name: 单向ESD; SupplierPart: C7519; ManufacturerPart: USBLC6-2SC6; Supplier Footprint: SOT-23-6L; JLCPCB Part Class: Extended Part; Datasheet: https://item.szlcsc.com/datasheet/USBLC6-2SC6/7996.html; Supplier: LCSC; ConvertToPcb: yes; FootprintName: SOT-23-6_L2.9-W1.6-P0.95-LS2.8-BL; Operating Temperature: -40℃~+125℃
D12 = MMSZ5242B-7-F: 二极管配置:1个独立式;稳压值(标称值):12V;稳压值(范围值):11.4V~12.6V;耗散功率(Pd):370mW;; Manufacturer: DIODES(美台); AddInBom: yes; ModelId: 528459655f7d4601a76356f3191c812b聨0819f05c4eef4c71ace90d822a990e87; ModelTransform: 151.575,66.929,0,0,0,0,0,0,0; Diode Configuration: 1个独立式; Zener Voltage(Nom): 12V; Reverse Leakage Current (Ir): 1uA@9.1V; Pd - Power Dissipation: 370mW; Impedance(Zzt): 30Ω; Impedance(Zzk): 600Ω; Operating Junction Temperature Range: -65℃~+150℃; Symbol: MMSZ5242B-7-F; Device: MMSZ5242B-7-F; LCSC Part Name: 独立式 耐压:12V 电流:1uA@9.1V; SupplierPart: C500776; ManufacturerPart: MMSZ5242B-7-F; Supplier Footprint: SOD-123; JLCPCB Part Class: Extended Part; Datasheet: https://item.szlcsc.com/datasheet/MMSZ5242B-7-F/513114.html; Supplier: LCSC; ConvertToPcb: yes; FootprintName: SOD-123_L2.7-W1.6-LS3.7-RD-1; ModelName: SOD-123_L2.7-W1.6-LS3.7-RD-1; Zener Voltage(Range): 11.4V~12.6V
F1 = 0468.500NRHF: 类型:贴片式保险丝;额定电流:500mA;额定电压:63V;分断能力:50A;; Manufacturer: Littelfuse(美国力特); AddInBom: yes; ModelId: f1628daad26847a79b887277a2bc8541聨0819f05c4eef4c71ace90d822a990e87; ModelName: F1206_L3.2-W1.7-H0.6; ModelTransform: 125.984,66.929,0,0,0,0,0,0,0; Type: 贴片式保险丝; Current Rating: 500mA; Voltage Rating (DC): 63V; Melting I2t: 0.031; Interrupt Rating: 50A; Symbol: 0468.500NRHF; Device: 0468.500NRHF; LCSC Part Name: 贴片式保险丝; SupplierPart: C206993; ManufacturerPart: 0468.500NRHF; Supplier Footprint: 1206; JLCPCB Part Class: Extended Part; Datasheet: https://item.szlcsc.com/datasheet/0468.500NRHF/208112.html; Supplier: LCSC; ConvertToPcb: yes; FootprintName: F1206; Operating Temperature: -55℃~+90℃; Diameter (φD): -; Length: 3.2mm; Width: 1.6mm; Height: 0.635mm; Pitch: -
H1 = LAIL-PZ2.54-2P-L: 插针结构:1x2P;间距:2.54mm;圆针/方针:方针;排数:单排;总PIN位数:2P;额定电流:3A;额定电压:250V;塑高:2.5mm;端接针长度:3mm;触头材质:黄铜;触头镀层:金;工作温度:-25℃~+80℃;颜色:黑色;; Manufacturer: 莱联; AddInBom: yes; Pin Structure: 1x2P; Pitch: 2.54mm; Circluar Pins/Square Pins: 方针; Current Rating: 3A; Voltage Rating (Max): 250V; Symbol: LAIL-PZ2.54-2P-L; Device: LAIL-PZ2.54-2P-L; LCSC Part Name: 1x2P 间距:2.54mm 方针; SupplierPart: C54950603; ManufacturerPart: LAIL-PZ2.54-2P-L; Supplier Footprint: 插件,P=2.54mm; JLCPCB Part Class: Extended Part; Datasheet: https://item.szlcsc.com/datasheet/LAIL-PZ2.54-2P-L/58519956.html; Supplier: LCSC; ConvertToPcb: yes; FootprintName: CONN-TH_LAIL-PZ2.54-2P-L; Number of Rows: 单排; Number of Pins: 2P; Insulation Height: 2.5mm; Length of End Connection Pin: 3mm; Contact Material: 黄铜; Contact Plating: 金; Operating Temperature: -25℃~+80℃; Color: 黑色
H2 = LAIL-PZ2.0-5P-L: 插针结构:1x5P;间距:2mm;圆针/方针:方针;排数:单排;总PIN位数:5P;额定电流:2A;额定电压:250V;塑高:2mm;端接针长度:2.8mm;触头材质:黄铜;触头镀层:金;工作温度:-25℃~+80℃;颜色:黑色;; Manufacturer: LAILAN(莱联); AddInBom: yes; Pin Structure: 1x5P; Pitch: 2mm; Circluar Pins/Square Pins: 方针; Current Rating: 2A; Voltage Rating (Max): 250V; Symbol: LAIL-PZ2.0-5P-L; Device: LAIL-PZ2.0-5P-L; LCSC Part Name: 1x5P 间距:2mm 方针; SupplierPart: C54950582; ManufacturerPart: LAIL-PZ2.0-5P-L; Supplier Footprint: 插件,P=2mm; JLCPCB Part Class: Extended Part; Datasheet: https://item.szlcsc.com/datasheet/LAIL-PZ2.0-5P-L/58519935.html; Supplier: LCSC; ConvertToPcb: yes; FootprintName: HDR-TH_LAIL-PZ2.0-5P-L; Number of Rows: 单排; Number of Pins: 5P; Insulation Height: 2mm; Length of End Connection Pin: 2.8mm; Contact Material: 黄铜; Contact Plating: 金; Operating Temperature: -25℃~+80℃; Color: 黑色
L1 = SWPA6045S220MT: 电感值:22uH;精度:±20%;额定电流:1.8A;饱和电流(Isat):2.2A;类型:-;; Manufacturer: Sunlord(顺络); AddInBom: yes; ModelId: 32cdbcb0fd69419d9d5b41a38560e127聨0819f05c4eef4c71ace90d822a990e87; ModelName: IND-SMD_L6.0-W6.0-H4.5; ModelTransform: 236.22,237.007,0,90,0,0,-0.001,0.001,0; Tolerance: ±20%; Current Rating: 1.8A; Current - Saturation(Isat): 2.2A; DC Resistance(DCR): 89mΩ; Symbol: SWPA6045S220MT; Device: SWPA6045S220MT; LCSC Part Name: 22uH ±20% 2.2A; SupplierPart: C83454; ManufacturerPart: SWPA6045S220MT; Supplier Footprint: SMD,6x6mm; JLCPCB Part Class: Extended Part; Datasheet: https://item.szlcsc.com/datasheet/SWPA6045S220MT/84618.html; Supplier: LCSC; ConvertToPcb: yes; FootprintName: IND-SMD_L6.0-W6.0_SWPA6045S; Value: 22uH; Type: -; Ratings: -
P1 = WJ500V-5.08-2P: 结构:1x2P;间距:5.08mm;颜色:绿色;安装方式:直插;额定电流:18A;额定电压:250V;排数:1;线规 - AWG:14~30;线规 - 平方毫米:2.5;每排PIN数:2;触头材质:-;触头镀层:-;工作温度范围:-40℃~+105℃;焊接温度(最大值):-;; Manufacturer: KANGNEX(康奈克斯电气); Symbol: WJ500V-5.08-2P-14-00A; 3D Model: 0f4a503c8d3b4ae19ed61267f5e9a1d7; 3D Model Transform: 423.621,393.7,0,0,0,0,-11.811,19.685,-137.795; Structure: 1x2P; Pitch: 5.08mm; Current Rating (Max): 18A; Voltage Rating (Max): 250V; Wire Gauge - AWG: 14~30; Wire Gauge - mm2: 2.5; Number of PINs Per Row: 2; Screw Specification: M2.5; AddInBom: yes; Device: WJ500V-5.08-2P; LCSC Part Name: 1x2P 5.08mm 直插 排数:1 每排P数:2; Supplier Part: C8465; Manufacturer Part: WJ500V-5.08-2P; Supplier Footprint: 插件,P=5.08mm; JLCPCB Part Class: 扩展库; Datasheet: https://atta.szlcsc.com/upload/public/pdf/source/20191225/C8465_02D34CE5B5B4A53DF5891601D97FA9F4.pdf; Supplier: LCSC; Color: 绿色; Mounting Style: 直插; Number of Pins: 2P; Number of Rows: 1; Contact Material: -; Contact Plating: -; Operating Temperature Range: -40℃~+105℃; Soldering Temperature(Max): -; ConvertToPcb: yes; FootprintName: CONN-TH_2P-P5.00_WJ500V-5.08-2P; ModelName: CONN-TH_2P-P5.00_WJ500V-5.08-2P
Q1-Q24 = 2N7002_C7420321: 数量:1个N沟道;漏源电压(Vdss):60V;连续漏极电流(Id):115mA;导通电阻(RDS(on)):900mΩ@10V;耗散功率(Pd):225mW;阈值电压(Vgs(th)):1.6V@250uA;; Manufacturer: R+O(宏嘉诚); 3D Model: c62791f0466c4ae2a892c056b845b0ca聨0819f05c4eef4c71ace90d822a990e87; 3D Model Transform: 98.425,114.173,0,180,0,0,0.0005,-0.0005,0; Number: 1个N沟道; Drain to Source Voltage: 60V; Current - Continuous Drain(Id): 115mA; Pd - Power Dissipation: 225mW; Gate Charge(Qg): 1.6nC@10V; Input Capacitance(Ciss): 50pF; Reverse Transfer Capacitance (Crss@Vds): 5pF; Type: N沟道; Output Capacitance(Coss): 25pF; AddInBom: yes; ModelName: SOT-23-3P_L2.9-W1.3-H1.0-LS2.4-P0.95; Symbol: 2N7002_C7420321; Device: 2N7002_C7420321; LCSC Part Name: N沟道,电流:115mA,耐压:60V; Supplier Part: C7420321; Manufacturer Part: 2N7002; Supplier Footprint: SOT-23; JLCPCB Part Class: Extended Part; Datasheet: https://item.szlcsc.com/datasheet/2N7002/8397143.html; Supplier: LCSC; RDS(on): 900mΩ@10V; Gate Threshold Voltage (Vgs(th)): 1.6V@250uA; Operating Temperature: -55℃~+150℃; ConvertToPcb: yes; FootprintName: SOT-23-3_L2.9-W1.3-P1.90-LS2.4-BR
Q25 = DMT10H015LFG-13: 数量:1个N沟道;漏源电压(Vdss):100V;连续漏极电流(Id):42A；10A;导通电阻(RDS(on)):13.5mΩ@10V;耗散功率(Pd):2W；35W;阈值电压(Vgs(th)):3.5V;; Manufacturer: DIODES(美台); AddInBom: yes; ModelId: ffb4bc7fd9f5455f82908568c15d55f5聨0819f05c4eef4c71ace90d822a990e87; ModelTransform: 130.708,130.708,0,0,0,0,0,0.002,0; Number: 1个N沟道; Drain to Source Voltage: 100V; Pd - Power Dissipation: 2W；35W; Gate Threshold Voltage (Vgs(th)): 3.5V; Gate Charge(Qg): 33.3nC@10V; Input Capacitance(Ciss): 1.871nF; Reverse Transfer Capacitance (Crss@Vds): 6.9pF; Symbol: DMT10H015LFG-13; Device: DMT10H015LFG-13; LCSC Part Name: 1个N沟道 耐压:100V 电流:42A 电流:10A; SupplierPart: C6021899; ManufacturerPart: DMT10H015LFG-13; Supplier Footprint: PowerDI3333-8; JLCPCB Part Class: Extended Part; Datasheet: https://item.szlcsc.com/datasheet/DMT10H015LFG-13/6960463.html; Supplier: LCSC; ConvertToPcb: yes; FootprintName: POWERDI3333-8_L3.3-W3.3-P0.65-LS3.7-BL-EP; ModelName: POWERDI3333-8_L3.3-W3.3-P0.65-LS3.7-BL-EP; Current - Continuous Drain(Id): 42A；10A; RDS(on): 13.5mΩ@10V; Operating Temperature: -55℃~+150℃
R1 R7-R14 R20-R36 R38-R41 R43-R52 R54-R56 R58-R63 R65 = RC0603FR-0710KL: 电阻类型:厚膜电阻;阻值:10kΩ;精度:±1%;功率:100mW;工作电压:75V;温度系数:±100ppm/℃;; Manufacturer: YAGEO(国巨); Add into BOM: yes; 3D Model: fc143cca1e79419f9cd78b61e9279f08; 3D Model Transform: 31.8897,63.7794,0,90,0,0,0,0,0; Tolerance: ±1%; Power(Watts): 100mW; Voltage-Supply(Max): 75V; Symbol: RC0603FR-0710KL; Device: RC0603FR-0710KL; Convert to PCB: yes; Supplier Footprint: 0603; Value: 10kΩ; LCSC Part Name: 厚膜电阻 10kΩ ±1% 100mW; Supplier Part: C98220; Manufacturer Part: RC0603FR-0710KL; JLCPCB Part Class: Extended Part; Datasheet: https://item.szlcsc.com/datasheet/RC0603FR-0710KL/99429.html; Supplier: LCSC; Temperature Coefficient: ±100ppm/℃; Type: 厚膜电阻; Operating Temperature: -55℃~+155℃; FootprintName: R0603; ModelName: R0603
R2-R5 R15-R18 = FRC0603F1000TS: 电阻类型:厚膜电阻;阻值:100Ω;精度:±1%;功率:100mW;工作电压:75V;温度系数:±100ppm/℃;; Manufacturer: FOJAN(富捷); Add into BOM: yes; 3D Model: fc143cca1e79419f9cd78b61e9279f08; 3D Model Transform: 31.8897,63.7794,0,90,0,0,0,0,0; Tolerance: ±1%; Power(Watts): 100mW; Voltage-Supply(Max): 75V; Symbol: FRC0603F1000TS; Device: FRC0603F1000TS; Convert to PCB: yes; Supplier Footprint: 0603; Value: 100Ω; LCSC Part Name: 100Ω ±1% 100mW 厚膜电阻; Supplier Part: C2906981; Manufacturer Part: FRC0603F1000TS; JLCPCB Part Class: Extended Part; Datasheet: https://item.szlcsc.com/datasheet/FRC0603F1000TS/3180494.html; Supplier: LCSC; Type: 厚膜电阻; Temperature Coefficient: ±100ppm/℃; Operating Temperature: -55℃~+155℃; FootprintName: R0603; ModelName: R0603
R6 R19 = FRC0603F0000TS: 电阻类型:厚膜电阻;阻值:0Ω;精度:±1%;功率:100mW;工作电压:75V;; Manufacturer: FOJAN(富捷); Add into BOM: yes; 3D Model: fc143cca1e79419f9cd78b61e9279f08; 3D Model Transform: 31.8897,63.7794,0,90,0,0,0,0,0; Tolerance: ±1%; Power(Watts): 100mW; Voltage-Supply(Max): 75V; Symbol: FRC0603F0000TS; Device: FRC0603F0000TS; Convert to PCB: yes; Supplier Footprint: 0603; Value: 0Ω; LCSC Part Name: 0Ω ±1% 100mW 厚膜电阻; Supplier Part: C2906974; Manufacturer Part: FRC0603F0000TS; JLCPCB Part Class: Extended Part; Supplier: LCSC; Type: 厚膜电阻; Operating Temperature: -55℃~+155℃; FootprintName: R0603; ModelName: R0603
R37 R66 = 0603WAF1003T5E: 电阻类型:厚膜电阻;阻值:100kΩ;精度:±1%;功率:100mW;工作电压:75V;温度系数:±100ppm/℃;; Manufacturer: UNI-ROYAL(厚声); Add into BOM: yes; 3D Model: fc143cca1e79419f9cd78b61e9279f08; 3D Model Transform: 31.8897,63.7794,0,90,0,0,0,0,0; Tolerance: ±1%; Power(Watts): 100mW; Voltage-Supply(Max): 75V; Symbol: 0603WAF1003T5E; Device: 0603WAF1003T5E; Convert to PCB: yes; Supplier Footprint: 0603; Value: 100kΩ; LCSC Part Name: 厚膜电阻 100kΩ ±1%; Supplier Part: C25803; Manufacturer Part: 0603WAF1003T5E; JLCPCB Part Class: Basic Part; Datasheet: https://item.szlcsc.com/datasheet/0603WAF1003T5E/26546.html; Supplier: LCSC; Type: 厚膜电阻; Temperature Coefficient: ±100ppm/℃; Operating Temperature: -55℃~+155℃; FootprintName: R0603; ModelName: R0603
R42 = FRC0603F4322TS: 电阻类型:厚膜电阻;阻值:43.2kΩ;精度:±1%;功率:100mW;工作电压:75V;温度系数:±100ppm/℃;; Manufacturer: FOJAN(富捷); Add into BOM: yes; 3D Model: fc143cca1e79419f9cd78b61e9279f08; 3D Model Transform: 31.8897,63.7794,0,90,0,0,0,0,0; Tolerance: ±1%; Power(Watts): 100mW; Voltage-Supply(Max): 75V; Symbol: FRC0603F4322TS; Device: FRC0603F4322TS; Convert to PCB: yes; Supplier Footprint: 0603; Value: 43.2kΩ; LCSC Part Name: 43.2kΩ ±1% 100mW 厚膜电阻; Supplier Part: C2930102; Manufacturer Part: FRC0603F4322TS; JLCPCB Part Class: Extended Part; Supplier: LCSC; Type: 厚膜电阻; Temperature Coefficient: ±100ppm/℃; Operating Temperature: -55℃~+155℃; FootprintName: R0603; ModelName: R0603
R53 R57 = FRC0603F5101TS: 电阻类型:厚膜电阻;阻值:5.1kΩ;精度:±1%;功率:100mW;工作电压:75V;温度系数:±100ppm/℃;; Manufacturer: FOJAN(富捷); Add into BOM: yes; 3D Model: fc143cca1e79419f9cd78b61e9279f08; 3D Model Transform: 31.8897,63.7794,0,90,0,0,0,0,0; Tolerance: ±1%; Power(Watts): 100mW; Voltage-Supply(Max): 75V; Symbol: FRC0603F5101TS; Device: FRC0603F5101TS; Convert to PCB: yes; Supplier Footprint: 0603; Value: 5.1kΩ; LCSC Part Name: 5.1kΩ ±1% 100mW 厚膜电阻; Supplier Part: C2907044; Manufacturer Part: FRC0603F5101TS; JLCPCB Part Class: Extended Part; Supplier: LCSC; Type: 厚膜电阻; Temperature Coefficient: ±100ppm/℃; Operating Temperature: -55℃~+155℃; FootprintName: R0603; ModelName: R0603
R64 = RC0603FR-0710KL: 电阻类型:厚膜电阻;阻值:10kΩ;精度:±1%;功率:100mW;工作电压:75V;温度系数:±100ppm/℃;; Manufacturer: YAGEO(国巨); Voltage-Supply(Max): 75V; Power(Watts): 100mW; Tolerance: ±1%; 3D Model Transform: 31.8897,63.7794,0,90,0,0,0,0,0; 3D Model: fc143cca1e79419f9cd78b61e9279f08; Convert to PCB: yes; Symbol: RC0603FR-0710KL; Device: RC0603FR-0710KL; Operating Temperature: -55℃~+155℃; Temperature Coefficient: ±100ppm/℃; Type: 厚膜电阻; Supplier: LCSC; Datasheet: https://item.szlcsc.com/datasheet/RC0603FR-0710KL/99429.html; JLCPCB Part Class: Extended Part; Manufacturer Part: RC0603FR-0710KL; Supplier Part: C98220; LCSC Part Name: 厚膜电阻 10kΩ ±1% 100mW; Supplier Footprint: 0603; Value: 10kΩ; Add into BOM: yes; FootprintName: R0603; ModelName: R0603
SW1 = TS-1088-AR02016: 电路结构:单刀单掷;按钮形状:圆形按钮;作用力:1.6N;安装方式:立贴;开关长度:3.9mm;开关宽度:3mm;开关高度:2mm;带支架:不带支架;触点电流:50mA;额定电压:12V;带灯:-;工作寿命:10万次;; Manufacturer: XUNPU(讯普); Add into BOM: yes; 3D Model: b26698b69f274ffabef8a26c7d0e5dd1; 3D Model Transform: 188.976,114.174,0,0,0,0,0,0,0; Circuit: 单刀单掷; Actuator Style: 圆形按钮; Operating Force: 1.6N; Switch Height: 2mm; with Bracket: 不带支架; Contact Current: 50mA; Voltage Rating: 12V; Actuator/Cap Color: 黑色; Life: 10万次; ModelName: SW-SMD_L3.9-W2.9-H2.0-LS4.8; Symbol: TS-1088-AR02016; Device: TS-1088-AR02016; Convert to PCB: yes; Supplier Footprint: SMD,4x3mm; LCSC Part Name: 3.9*3*2mm 立贴 轻触开关; Supplier Part: C720477; Manufacturer Part: TS-1088-AR02016; JLCPCB Part Class: Basic Part; Datasheet: https://item.szlcsc.com/datasheet/TS-1088-AR02016/763484.html; Supplier: LCSC; Mounting Type: 立贴; Length: 3.9mm; Width: 3mm; With Lamp: -; IP Rating: -; Termination Style: SMD接片; Operating Temperature: -30℃~+80℃; FootprintName: SW-SMD_L3.9-W3.0-P4.45
U1 = STM32F103C8T6: CPU内核:ARM Cortex-M3;CPU最大主频:72MHz;CPU位数:32 Bit;; Manufacturer: ST(意法半导体); AddInBom: yes; ModelId: 093be70396ff421eb2cdb946d5311efc聨0819f05c4eef4c71ace90d822a990e87; ModelName: LQFP-48_L7.0-W7.0-H1.4-LS9.0-P0.50; ModelTransform: 354.331,354.331,0,0,0,0,0,0,0; CPU Maximum Speed: 72MHz; Core Size: 32 Bit; Program Storage Size: 64KB; Program Memory Type: FLASH; RAM Size: 20KB; Number of I/O: 37; ADC (Bit): 12bit; Oscillator Type: 内置; Voltage - Supply: 2V~3.6V; Symbol: STM32F103C8T6; Device: STM32F103C8T6; LCSC Part Name: 主流增强型ARM Cortex-M3 MCU，具有64 KB Flash、72 MHz CPU、电机控制、USB和CAN; SupplierPart: C8734; ManufacturerPart: STM32F103C8T6; Supplier Footprint: LQFP-48(7x7); JLCPCB Part Class: Extended Part; Datasheet: https://item.szlcsc.com/datasheet/STM32F103C8T6/9243.html; Supplier: LCSC; ConvertToPcb: yes; FootprintName: LQFP-48_L7.0-W7.0-P0.50-LS9.0-BL; CPU Core: ARM Cortex-M3; EEPROM: -; Operating Temperature: -40℃~+85℃
U2 = LMR36510FADDAR: 功能类型:降压型;工作电压:4.2V~65V;输出电压:1V~28V;输出电流:1A;输出类型:可调;; Manufacturer: TI(德州仪器); AddInBom: yes; ModelId: 1edf17d9e1eb44b9aabe355eb95382d1聨0819f05c4eef4c71ace90d822a990e87; ModelTransform: 192.913,236.22,0,0,0,0,0,0,0; Function: 降压型; Output Voltage: 1V~28V; Output Current: 1A; Frequency - Switching: 400kHz; Synchronous Rectifier: 是; Number of Outputs: 1; Topology: 降压式; Quiescent Current: 26uA; Switch tube (built-in/external): 内置; Output Type: 可调; Symbol: LMR36510FADDAR; Device: LMR36510FADDAR; LCSC Part Name: 降压型 1A 4.2V~65V; SupplierPart: C1858394; ManufacturerPart: LMR36510FADDAR; Supplier Footprint: ESOP-8; JLCPCB Part Class: Extended Part; Datasheet: https://www.ti.com/cn/lit/ds/symlink/lmr36510.pdf; Supplier: LCSC; ConvertToPcb: yes; FootprintName: ESOP-8_L4.9-W3.9-P1.27-LS6.0-BL-EP-1; ModelName: ESOP-8_L4.9-W3.9-P1.27-LS6.0-BL-EP-1; Voltage - Supply: 4.2V~65V; Operating Temperature: -40℃~+125℃@(TJ); Features: 轻载高效模式；内置LDO稳压器；逐波限流；工作状态指示；打嗝限流
U3 = CH340C: 应用功能:收发器;USB协议版本:USB 2.0;通道数:-;数据速率:2Mbps;; Manufacturer: WCH(南京沁恒); AddInBom: yes; ModelId: 3361a6792abf4a8f8fbca4f1924a67ee聨0819f05c4eef4c71ace90d822a990e87; ModelName: SOP-16_L9.9-W3.9-H1.5-LS6.0-P1.27; ModelTransform: 240.39054,393.7,0,90,0,0,0,0,0; Applications Function: 收发器; USB Protocol: USB 2.0; Voltage - Supply: 3.3V；5V; Data Rate: 2Mbps; Current - Supply: 7mA; Quiescent Supply Current: 50uA; Symbol: CH340C; Device: CH340C; LCSC Part Name: USB转串口芯片; SupplierPart: C84681; ManufacturerPart: CH340C; Supplier Footprint: SOP-16; JLCPCB Part Class: Extended Part; Datasheet: https://item.szlcsc.com/datasheet/CH340C/85852.html; Supplier: LCSC; ConvertToPcb: yes; FootprintName: SOP-16_L10.0-W3.9-P1.27-LS6.0-BL; Number of Channels: -; Operating Temperature: -20℃~+70℃; Features: 可编程波特率；内置时钟发生器；上电复位
U4 = ISO7721DR: ISO7721 EMC 性能优异的双通道、1/1、增强型数字隔离器; Manufacturer: TI(德州仪器); AddInBom: yes; ModelId: 7abc64c95a1a4a04a4ef38f9097c870b聨0819f05c4eef4c71ace90d822a990e87; ModelTransform: 192.913,236.22,0,0,0,0,0,0,0; Number of Forward Channels: 1; Data Rate(Max): 100Mbps; Default Output: 高电平; Isolation Voltage(Vrms): 5000; CMTI(kV/us): 100kV/us; Propagation Delay(tpd): 11ns; Voltage - Supply(VCCA): 2.25V~5.5V; Symbol: ISO7721DR; Device: ISO7721DR; LCSC Part Name: EMC性能优异的高速 增强型和基础型双通道数字隔离器; SupplierPart: C366164; ManufacturerPart: ISO7721DR; Supplier Footprint: SOIC-8; JLCPCB Part Class: Extended Part; Datasheet: https://www.ti.com/cn/lit/gpn/iso7721; Supplier: LCSC; ConvertToPcb: yes; FootprintName: SOIC-8_L5.0-W4.0-P1.27-LS6.0-BL; ModelName: SOIC-8_L5.0-W4.0-P1.27-LS6.0-BL; Number of Reverse Channels: 1; Features: 失效安全输出; Voltage - Supply(VCCB): 2.25V~5.5V; Operating Temperature: -55℃~+125℃
USBC1 = TYPE-C-31-M-12: 连接器类型:Type-C;协议标准:-;公母:母;安装方式:卧贴;触点数量:16P;端口数量:1;额定电流 - 电源:5A;工作温度:-30℃~+80℃;; Manufacturer: 韩国韩荣; AddInBom: yes; ModelId: 2a22bb5af8894b85972aeeacf9cd92d0聨0819f05c4eef4c71ace90d822a990e87; ModelTransform: 351.9678,311.023,0,180,0,0,0,-43.307,-33.465; Connector Type: Type-C; Gender: 母; Number of Contacts: 16P; Number of Ports: 1; Current Rating-Power: 5A; Voltage Rating: 20V; Connect-Disconnect Life: 1万次; Symbol: TYPE-C-31-M-12; Device: TYPE-C-31-M-12; LCSC Part Name: Type-C 母 卧贴; SupplierPart: C165948; ManufacturerPart: TYPE-C-31-M-12; Supplier Footprint: SMD; JLCPCB Part Class: Extended Part; Datasheet: https://item.szlcsc.com/datasheet/TYPE-C-31-M-12/177331.html; Supplier: LCSC; ConvertToPcb: yes; FootprintName: USB-C_SMD-TYPE-C-31-M-12_1; ModelName: USB-C_SMD-TYPE-C-31-M-12_1; Protocol Standard: -; Mounting Type: 卧贴; Length: 7.35mm; Operating Temperature: -30℃~+80℃
X1 = SX32Y008000BC1T001: 晶振类型:贴片晶振;频率:8MHz;常温频差:±10ppm;负载电容:12pF;频率稳定度:±30ppm;; Manufacturer: TKD(泰晶); AddInBom: yes; ModelId: ff2dfd5650294453a14147960efe1838聨0819f05c4eef4c71ace90d822a990e87; ModelTransform: 125.984,98.425,0,0,0,0,0,0,0; Normal temperature Frequency Tolerance: ±10ppm; Load Capacitance: 12pF; Frequency Stability: ±30ppm; Equivalent Series Resistance(ESR): 300Ω; Symbol: SX32Y008000BC1T001; Device: SX32Y008000BC1T001; LCSC Part Name: 8MHz ±10ppm 12pF; SupplierPart: C20617233; ManufacturerPart: SX32Y008000BC1T001; Supplier Footprint: SMD3225-4P; JLCPCB Part Class: Extended Part; Datasheet: https://item.szlcsc.com/datasheet/SX32Y008000BC1T001/21988737.html; Supplier: LCSC; ConvertToPcb: yes; FootprintName: CRYSTAL-SMD_4P-L3.2-W2.5-BL; ModelName: CRYSTAL-SMD_4P-L3.2-W2.5-BL; Type: 贴片晶振; Value: 8MHz; Operating Temperature: -40℃~+85℃